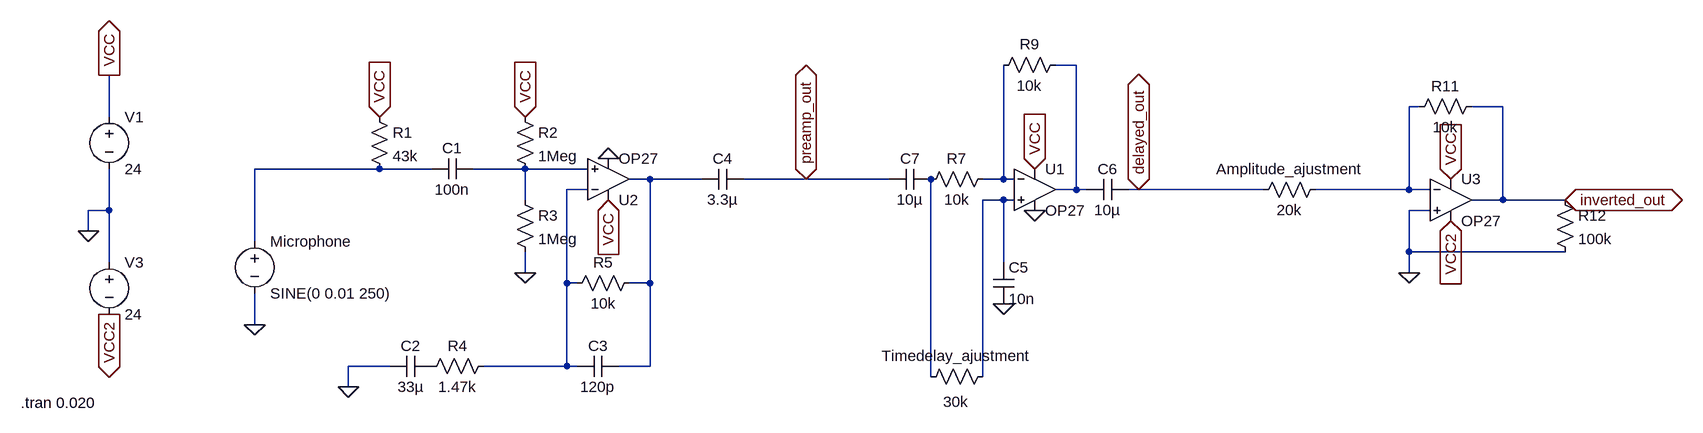
[diagram p0: schematic ANC.asc]
ANC.asc, the LTspice schematic file:
Version 4
SHEET 1 2528 680
WIRE 1568 -144 1536 -144
WIRE 2096 -80 2080 -80
WIRE 2224 -80 2176 -80
WIRE 80 -64 80 -128
WIRE 496 16 304 16
WIRE 576 16 496 16
WIRE 720 16 640 16
WIRE 816 16 720 16
WIRE 912 32 880 32
WIRE 992 32 912 32
WIRE 1152 32 1056 32
WIRE 1280 32 1152 32
WIRE 1456 32 1456 -144
WIRE 1456 32 1424 32
WIRE 1472 32 1456 32
WIRE 816 48 784 48
WIRE 1568 48 1568 -144
WIRE 1568 48 1536 48
WIRE 1584 48 1568 48
WIRE 1664 48 1648 48
WIRE 1856 48 1664 48
WIRE 2080 48 2080 -80
WIRE 2080 48 1936 48
WIRE 2112 48 2080 48
WIRE 720 64 720 16
WIRE 1456 64 1424 64
WIRE 1472 64 1456 64
WIRE 2224 64 2224 -80
WIRE 2224 64 2176 64
WIRE 2320 64 2224 64
WIRE 80 80 80 16
WIRE 80 80 48 80
WIRE 2112 80 2080 80
WIRE 48 112 48 80
WIRE 304 128 304 16
WIRE 2080 144 2080 80
WIRE 2320 144 2080 144
WIRE 80 160 80 80
WIRE 1456 160 1456 64
WIRE 720 176 720 144
WIRE 2080 176 2080 144
WIRE 784 192 784 48
WIRE 800 192 784 192
WIRE 912 192 912 32
WIRE 912 192 880 192
WIRE 304 256 304 208
WIRE 512 320 448 320
WIRE 784 320 784 192
WIRE 784 320 656 320
WIRE 800 320 784 320
WIRE 912 320 912 192
WIRE 912 320 864 320
WIRE 1344 336 1344 32
WIRE 1424 336 1424 64
WIRE 448 352 448 320
FLAG 80 -128 VCC
IOPIN 80 -128 Out
FLAG 304 256 0
FLAG 448 352 0
FLAG 720 176 0
FLAG 496 -64 VCC
IOPIN 496 -64 In
FLAG 720 -64 VCC
IOPIN 720 -64 In
FLAG 848 64 VCC
IOPIN 848 64 In
FLAG 848 0 0
FLAG 80 240 VCC2
IOPIN 80 240 Out
FLAG 1456 224 0
FLAG 1504 16 VCC
IOPIN 1504 16 In
FLAG 1504 80 0
FLAG 2080 176 0
FLAG 2144 32 VCC
IOPIN 2144 32 In
FLAG 2144 96 VCC2
IOPIN 2144 96 In
FLAG 48 112 0
FLAG 1152 32 preamp_out
IOPIN 1152 32 BiDir
FLAG 1664 48 delayed_out
IOPIN 1664 48 BiDir
FLAG 2320 64 inverted_out
IOPIN 2320 64 BiDir
SYMBOL voltage 80 -80 R0
WINDOW 123 0 0 Left 0
WINDOW 39 24 124 Left 2
SYMATTR InstName V1
SYMATTR Value 24
SYMBOL voltage 304 112 R0
WINDOW 123 0 0 Left 0
WINDOW 39 0 0 Left 0
SYMATTR InstName Microphone
SYMATTR Value SINE(0 0.01 250)
SYMBOL res 480 -80 R0
SYMATTR InstName R1
SYMATTR Value 43k
SYMBOL cap 640 0 R90
WINDOW 0 0 32 VBottom 2
WINDOW 3 32 32 VTop 2
SYMATTR InstName C1
SYMATTR Value 100n
SYMBOL res 704 -80 R0
SYMATTR InstName R2
SYMATTR Value 1Meg
SYMBOL res 704 48 R0
SYMATTR InstName R3
SYMATTR Value 1Meg
SYMBOL res 672 304 R90
WINDOW 0 0 56 VBottom 2
WINDOW 3 32 56 VTop 2
SYMATTR InstName R4
SYMATTR Value 1.47k
SYMBOL cap 576 304 R90
WINDOW 0 0 32 VBottom 2
WINDOW 3 32 32 VTop 2
SYMATTR InstName C2
SYMATTR Value 33µ
SYMBOL OpAmps\\OP27 848 96 M180
SYMATTR InstName U2
SYMBOL res 896 176 R90
WINDOW 0 0 56 VBottom 2
WINDOW 3 32 56 VTop 2
SYMATTR InstName R5
SYMATTR Value 10k
SYMBOL cap 864 304 R90
WINDOW 0 0 32 VBottom 2
WINDOW 3 32 32 VTop 2
SYMATTR InstName C3
SYMATTR Value 120p
SYMBOL cap 1056 16 R90
WINDOW 0 0 32 VBottom 2
WINDOW 3 32 32 VTop 2
SYMATTR InstName C4
SYMATTR Value 3.3µ
SYMBOL voltage 80 144 R0
WINDOW 123 0 0 Left 0
WINDOW 39 0 0 Left 0
SYMATTR InstName V3
SYMATTR Value 24
SYMBOL OpAmps\\OP27 1504 -16 R0
SYMATTR InstName U1
SYMBOL res 1440 16 R90
WINDOW 0 0 56 VBottom 2
WINDOW 3 32 56 VTop 2
SYMATTR InstName R7
SYMATTR Value 10k
SYMBOL res 1440 320 R90
WINDOW 0 0 56 VBottom 2
WINDOW 3 39 57 VTop 2
SYMATTR InstName Timedelay_ajustment
SYMATTR Value 30k
SYMBOL cap 1440 160 R0
SYMATTR InstName C5
SYMATTR Value 10n
SYMBOL res 1552 -160 R90
WINDOW 0 0 56 VBottom 2
WINDOW 3 32 56 VTop 2
SYMATTR InstName R9
SYMATTR Value 10k
SYMBOL OpAmps\\OP27 2144 0 R0
SYMATTR InstName U3
SYMBOL res 1952 32 R90
WINDOW 0 0 56 VBottom 2
WINDOW 3 32 56 VTop 2
SYMATTR InstName Amplitude_ajustment
SYMATTR Value 20k
SYMBOL res 2192 -96 R90
WINDOW 0 0 56 VBottom 2
WINDOW 3 32 56 VTop 2
SYMATTR InstName R11
SYMATTR Value 10k
SYMBOL res 2304 48 R0
SYMATTR InstName R12
SYMATTR Value 100k
SYMBOL cap 1648 32 R90
WINDOW 0 0 32 VBottom 2
WINDOW 3 32 32 VTop 2
SYMATTR InstName C6
SYMATTR Value 10µ
SYMBOL cap 1344 16 R90
WINDOW 0 0 32 VBottom 2
WINDOW 3 32 32 VTop 2
SYMATTR InstName C7
SYMATTR Value 10µ
TEXT -56 376 Left 2 !.tran 0.020

The netlist it stands for:
* ANC.asc
V1 VCC 0 24
V§Microphone N003 0 SINE(0 0.01 250)
R1 VCC N003 43k
C1 N004 N003 100n
R2 VCC N004 1Meg
R3 N004 0 1Meg
R4 N007 P001 1.47k
C2 P001 0 33µ
XU2 N004 N007 VCC 0 N005 OP27  ; pins In+ In- V+ V- OUT
R5 N005 N007 10k
C3 N005 N007 120p
C4 preamp_out N005 3.3µ
V3 0 VCC2 24
XU1 N008 N006 VCC 0 N001 OP27  ; pins In+ In- V+ V- OUT
R7 N006 N009 10k
R§Timedelay_ajustment N008 N009 30k
C5 N008 0 10n
R9 N001 N006 10k
XU3 0 N002 VCC VCC2 inverted_out OP27  ; pins In+ In- V+ V- OUT
R§Amplitude_ajustment N002 delayed_out 20k
R11 inverted_out N002 10k
R12 inverted_out 0 100k
C6 delayed_out N001 10µ
C7 N009 preamp_out 10µ
.tran 0.020
.lib ADI.lib
.backanno
.end